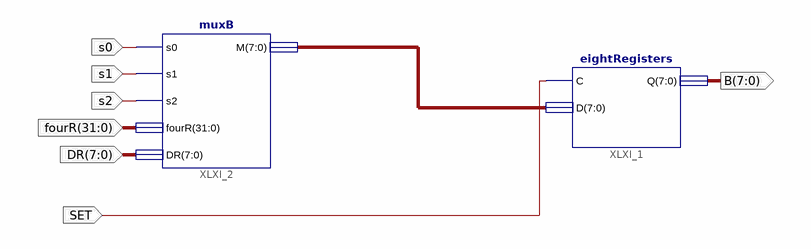
[diagram p0: schematic sheet 1]
// Xilinx ISE schematic B.sch (spartan3e) as structural Verilog: 2 symbols, 7 ports
module B (
  input  SET,
  input  [31:0] fourR,
  input  [7:0] DR,
  input  s2,
  input  s1,
  input  s0,
  output [7:0] B
);

  wire [7:0] XLXN_3;

  eightRegisters XLXI_1 (.C(SET), .D(XLXN_3), .Q(B));
  muxB XLXI_2 (.s0(s0), .s1(s1), .s2(s2), .fourR(fourR), .DR(DR), .M(XLXN_3));
endmodule
